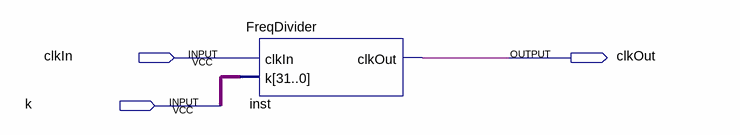
[diagram p0: schematic sheet]
// Quartus schematic FreqDivider_Demo.bdf as structural Verilog: 1 symbols, 3 pins
module FreqDivider_Demo (
  input  clkIn,
  input  k,
  output clkOut
);

  wire [31:0] undriven;

  FreqDivider inst (.clkIn(clkIn), .k(undriven), .clkOut(clkOut));
endmodule
